# Altium schematic sheet 04_SHIELD_SLOT_B.SchDoc: Slot B for Lophilo Shield
size 381 x 266 mm; Organization: Meteroi; Address1: Room 428, 410 Guiping Rd.; Address2: Shanghai 200233, CHINA; SheetNumber: 4; SheetTotal: 9; PageSetup: Record=PageOptions|CenterHorizontal=True|CenterVertical=True|PrintScale=0.75|XCorrection=1.00|YCorrection=1.00|PrintKind=2|BorderSize=5000000|LeftOffset=0|BottomOffset=0|Orientation=2|PaperLength=1000|PaperWidth=1000|Scale=100|PaperSource=276|PrintQuality=-3|MediaType=1|DitherType=10|PaperKind=A4|PrintScaleMode=1
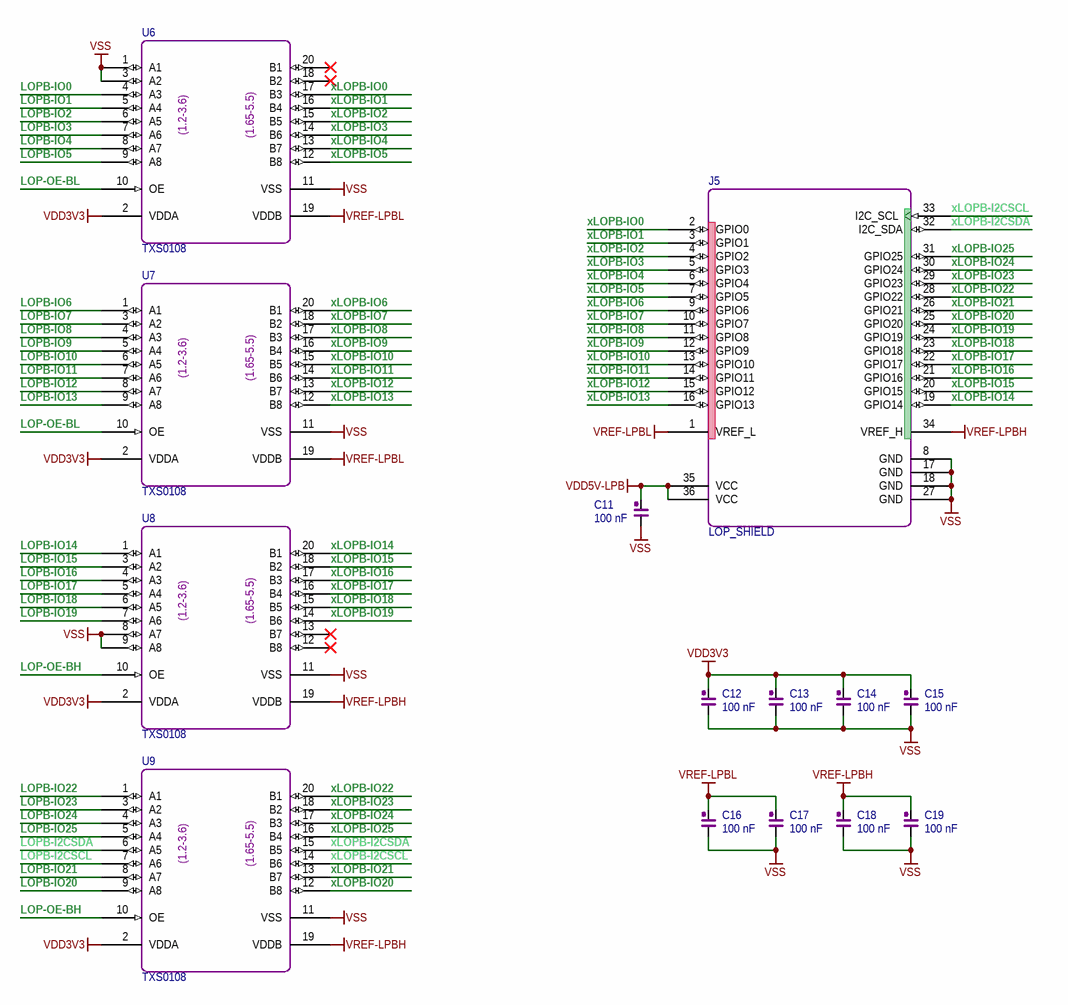
[diagram p0: 04_SHIELD_SLOT_B.SchDoc]

## Parts
C11  100 nF  [0603A1]
C12  100 nF  [0603A1]
C13  100 nF  [0603A1]
C14  100 nF  [0603A1]
C15  100 nF  [0603A1]
C16  100 nF  [0603A1]
C17  100 nF  [0603A1]
C18  100 nF  [0603A1]
C19  100 nF  [0603A1]
J5  LOP_SHIELD  [LOP_SHIELD]
U6  TXS0108  [TSSOP-20]
U7  TXS0108  [TSSOP-20]
U8  TXS0108  [TSSOP-20]
U9  TXS0108  [TSSOP-20]

## Nets
VDD3V3: C12.2 C13.2 C14.2 C15.2 U6.2(VDDA) U7.2(VDDA) U8.2(VDDA) U9.2(VDDA)
VDD5V-LPB: C11.2 J5.35(VCC) J5.36(VCC)
VREF-LPBH: C18.2 C19.2 J5.34(VREF_H) U8.19(VDDB) U9.19(VDDB)
VREF-LPBL: C16.2 C17.2 J5.1(VREF_L) U6.19(VDDB) U7.19(VDDB)
VSS: C11.1 C12.1 C13.1 C14.1 C15.1 C16.1 C17.1 C18.1 C19.1 J5.8(GND) J5.17(GND) J5.18(GND) J5.27(GND) U6.1(A1) U6.3(A2) U6.11(VSS) U7.11(VSS) U8.8(A7) U8.9(A8) U8.11(VSS) U9.11(VSS)
LOP-OE-BH: U8.10(OE) U9.10(OE)
LOP-OE-BL: U6.10(OE) U7.10(OE)
LOPB-I2CSCL: U9.7(A6)
LOPB-I2CSDA: U9.6(A5)
LOPB-IO0: U6.4(A3)
LOPB-IO1: U6.5(A4)
LOPB-IO2: U6.6(A5)
LOPB-IO3: U6.7(A6)
LOPB-IO4: U6.8(A7)
LOPB-IO5: U6.9(A8)
LOPB-IO6: U7.1(A1)
LOPB-IO7: U7.3(A2)
LOPB-IO8: U7.4(A3)
LOPB-IO9: U7.5(A4)
LOPB-IO10: U7.6(A5)
LOPB-IO11: U7.7(A6)
LOPB-IO12: U7.8(A7)
LOPB-IO13: U7.9(A8)
LOPB-IO14: U8.1(A1)
LOPB-IO15: U8.3(A2)
LOPB-IO16: U8.4(A3)
LOPB-IO17: U8.5(A4)
LOPB-IO18: U8.6(A5)
LOPB-IO19: U8.7(A6)
LOPB-IO20: U9.9(A8)
LOPB-IO21: U9.8(A7)
LOPB-IO22: U9.1(A1)
LOPB-IO23: U9.3(A2)
LOPB-IO24: U9.4(A3)
LOPB-IO25: U9.5(A4)
xLOPB-I2CSCL: J5.33(I2C_SCL) U9.14(B6)
xLOPB-I2CSDA: J5.32(I2C_SDA) U9.15(B5)
xLOPB-IO0: J5.2(GPIO0) U6.17(B3)
xLOPB-IO1: J5.3(GPIO1) U6.16(B4)
xLOPB-IO2: J5.4(GPIO2) U6.15(B5)
xLOPB-IO3: J5.5(GPIO3) U6.14(B6)
xLOPB-IO4: J5.6(GPIO4) U6.13(B7)
xLOPB-IO5: J5.7(GPIO5) U6.12(B8)
xLOPB-IO6: J5.9(GPIO6) U7.20(B1)
xLOPB-IO7: J5.10(GPIO7) U7.18(B2)
xLOPB-IO8: J5.11(GPIO8) U7.17(B3)
xLOPB-IO9: J5.12(GPIO9) U7.16(B4)
xLOPB-IO10: J5.13(GPIO10) U7.15(B5)
xLOPB-IO11: J5.14(GPIO11) U7.14(B6)
xLOPB-IO12: J5.15(GPIO12) U7.13(B7)
xLOPB-IO13: J5.16(GPIO13) U7.12(B8)
xLOPB-IO14: J5.19(GPIO14) U8.20(B1)
xLOPB-IO15: J5.20(GPIO15) U8.18(B2)
xLOPB-IO16: J5.21(GPIO16) U8.17(B3)
xLOPB-IO17: J5.22(GPIO17) U8.16(B4)
xLOPB-IO18: J5.23(GPIO18) U8.15(B5)
xLOPB-IO19: J5.24(GPIO19) U8.14(B6)
xLOPB-IO20: J5.25(GPIO20) U9.12(B8)
xLOPB-IO21: J5.26(GPIO21) U9.13(B7)
xLOPB-IO22: J5.28(GPIO22) U9.20(B1)
xLOPB-IO23: J5.29(GPIO23) U9.18(B2)
xLOPB-IO24: J5.30(GPIO24) U9.17(B3)
xLOPB-IO25: J5.31(GPIO25) U9.16(B4)

Not connected (* = marked no-connect by the designer): U6 18(B2)* 20(B1)*; U8 12(B8)* 13(B7)*

## Notes on the sheet
- Title:
- Project:
- Sheet:
- Of
- Size:
- D/N:
- Rev:
- Date:
- P/N:
- S/N:
- Designer:
- C
- (in symbol TXS0108) (1.2-3.6); (1.65-5.5)

## Library data of the parts
C11-C19 = CAP: Normal Capacitor; PartNumber: 0; Vendor: muRata; Designer: shyul; PinCountSMD: 2; Value: 100 nF; SerialNumber: 0; Publisher: Cowin; PCBMarker: Capacitor; Version: 1.0; VersionDate: 04-27-2011; PinCountHole: 0
J5 = LOP_SHIELD: Lophilo Shield Module Slot; Vendor: 0; PinCountHole: 36; Designer: shyul; Value: LOP_SHIELD; PartNumber: LOP_SHIELD; Version: 1.0; VersionDate: 03-19-2012; PinCountSMD: 0; SerialNumber: 0; Publisher: Cowin; PCBMarker: LOP_SHIELD
U6-U9 = TXS0108: 8-bit Translator; Vendor: TI; Designer: shyul; PinCountSMD: 20; PinCountHole: 0; PCBMarker: 8-bit Translator; PartNumber: TXS0108; Value: TXS0108; Version: 1.0; VersionDate: 05-23-2011; Publisher: Cowin; SerialNumber: 0